# Altium schematic sheet CW308A_Generic_conns.SchDoc
size A4
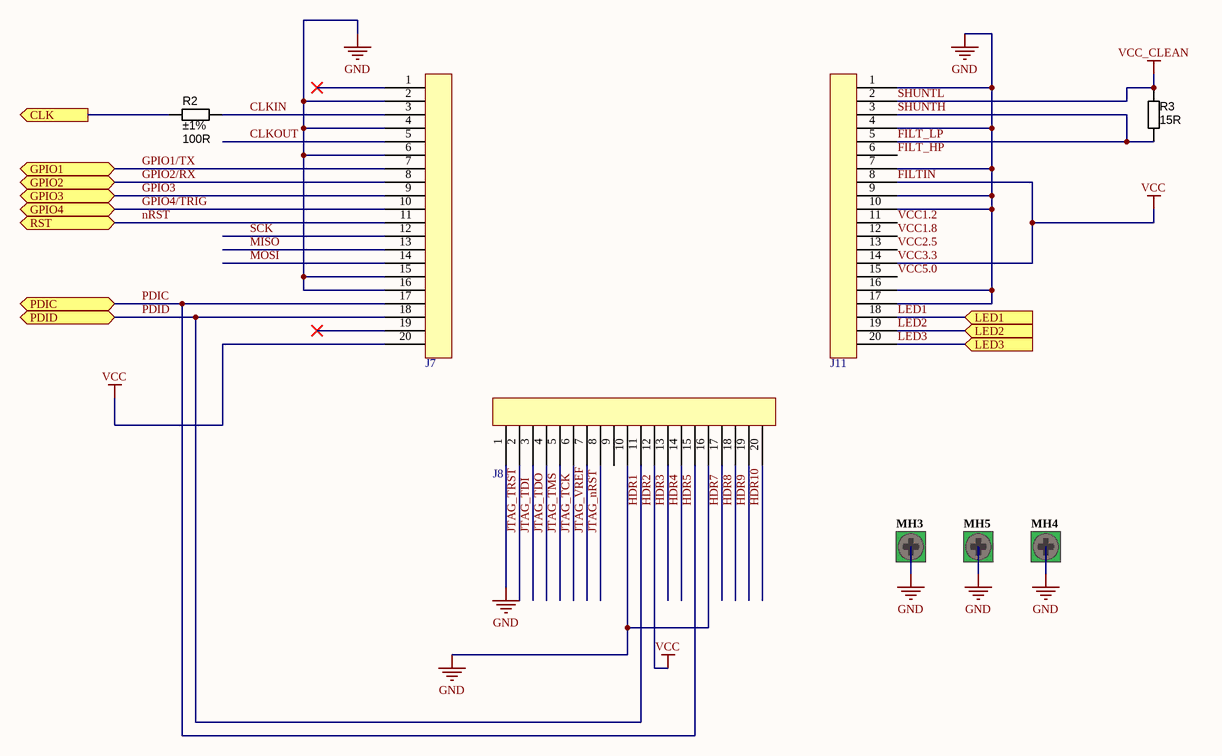
[diagram p0: CW308A_Generic_conns.SchDoc]

## Parts
J7  20-Pin Header  [801-87-020-10-001101]  (value not drawn)
J8  20-Pin Header  [801-87-020-10-001101]  (value not drawn)
J11  20-Pin Header  [801-87-020-10-001101]  (value not drawn)
MH3  Mounting-Hole-RND-Altium  [Mounting-Hole-RND-Altium]  (value not drawn)  (no BOM)
MH4  Mounting-Hole-RND-Altium  [Mounting-Hole-RND-Altium]  (value not drawn)  (no BOM)
MH5  Mounting-Hole-RND-Altium  [Mounting-Hole-RND-Altium]  (value not drawn)  (no BOM)
R2  value 100R  Tolerance: ±1%  [RESC1608X55N]  (hidden comment: Thick Film)
R3  value 15R  [RESC2012X70N]  (hidden comment: Thick Film)

## Ports
CLK (out), GPIO1 (bidir), GPIO2 (bidir), GPIO3 (bidir), GPIO4 (bidir), LED1 (in), LED2 (in), LED3 (in), PDIC (bidir), PDID (bidir), RST (bidir)

## Nets
FILTIN: J7.20 J8.12 J11.8 J11.14  [also labelled HDR2, VCC, VCC3.3]
GND: J7.2 J7.4 J7.6 J7.15 J7.16 J8.1 J8.10 J8.16 J11.1 J11.4 J11.7 J11.9 J11.10 J11.16 J11.17 MH3.1 MH4.1 MH5.1
SHUNTL: J11.2 R3.1  [also labelled VCC_CLEAN]
CLK: R2.1 ; port CLK
CLKIN: J7.3 R2.2
CLKOUT: J7.5
FILT_HP: J11.6
FILT_LP: J11.3 J11.5 R3.2  [also labelled SHUNTH]
GPIO1/TX: J7.7 ; port GPIO1
GPIO2/RX: J7.8 ; port GPIO2
GPIO3: J7.9 ; port GPIO3
GPIO4/TRIG: J7.10 ; port GPIO4
HDR1: J7.18 J8.11 ; port PDID  [also labelled PDID]
HDR3: J8.13
HDR4: J8.14
HDR5: J7.17 J8.15 ; port PDIC  [also labelled PDIC]
HDR7: J8.17
HDR8: J8.18
HDR9: J8.19
HDR10: J8.20
JTAG_nRST: J8.8
JTAG_TCK: J8.6
JTAG_TDI: J8.3
JTAG_TDO: J8.4
JTAG_TMS: J8.5
JTAG_TRST: J8.2
JTAG_VREF: J8.7
LED1: J11.18 ; port LED1
LED2: J11.19 ; port LED2
LED3: J11.20 ; port LED3
MISO: J7.13
MOSI: J7.14
nRST: J7.11 ; port RST
SCK: J7.12
VCC1.2: J11.11
VCC1.8: J11.12
VCC2.5: J11.13
VCC5.0: J11.15

Not connected (* = marked no-connect by the designer): J7 1* 19*; J8 9

## Library data of the parts
J7 J8 J11 = 801-87-020-10-001101: 1x20 Header, Machined; Manufacture 1: Preci-Dip SA; Manufacture Part Number 1: 801-87-020-10-001101; Supplier 1: Digi-Key; Supplier Part Number 1: 1212-1207-ND
MH3-MH5 = CMP-0001-00029-1: Mounting Hole, Altium, 4.4mm pad, 3.4mm plated hole; Publisher: Altium; ClassName: Mounting Hole
R2 = RES_100R_0603_1%: Resistor SMD chip 100 Ohm 0.1W 1% 0603; Manufacturer 1: Yageo; Manufacturer Part Number 1: RC0603FR-07100RL; Ratings: 1/10 W; SCDType: spec; Package / Case: 0603 (1608 Metric); Material: Thick Film; Supplier 1: Digi-Key; Supplier Part Number 1: 311-100HRCT-ND; Supplier 2: Digi-Key; Supplier Part Number 2: P100HTR-ND; Manufacturer 2: Panasonic - ECG; Manufacturer Part Number 2: ERJ-3EKF1000V; ComponentLink1URL: http://industrial.panasonic.com/www-cgi/jvcr13pz.cgi?E+PZ+3+AOA0002+ERJ3EKF1000V+7+WW; ComponentLink1Description: http://industrial.panasonic.com/www-cgi/jvcr13pz.cgi?E+PZ+3+AOA0002+ERJ3EKF1000V+7+WW
R3 = RES_15R_0805_5%: Resistor SMD chip 15 Ohm 0.125W 5% 0805; Manufacturer 1: Yageo; Manufacturer Part Number 1: RC0805JR-0715RL; Ratings: 1/8W; SCDType: spec; Tolerance: ±5%; Package / Case: 0805 (2012 metric); Supplier 1: Digi-Key; Supplier Part Number 1: 311-15ARCT-ND; RoHS 1: RoHS Compliant; ComponentLink1URL: http://media.digikey.com/pdf/Data%20Sheets/Yageo%20PDFs/RC0805%20Pb%20Free.pdf; ComponentLink1Description: http://media.digikey.com/pdf/Data%20Sheets/Yageo%20PDFs/RC0805%20Pb%20Free.pdf; Supplier 2: Digi-Key; Supplier Part Number 2: P15ACT-ND; Manufacturer 2: Panasonic Electronic Components; Manufacturer Part Number 2: ERJ-6GEYJ150V; RoHS 2: RoHS Compliant; ComponentLink2URL: http://industrial.panasonic.com/www-cgi/jvcr13pz.cgi?E+PZ+3+AOA0001+ERJ6GEYJ150V+7+WW; ComponentLink2Description: http://industrial.panasonic.com/www-cgi/jvcr13pz.cgi?E+PZ+3+AOA0001+ERJ6GEYJ150V+7+WW; Supplier 3: Digi-Key; Supplier Part Number 3: RMCF0805JT15R0CT-ND; Manufacturer 3: Stackpole Electronics Inc; Manufacturer Part Number 3: RMCF0805JT15R0; RoHS 3: RoHS Compliant; ComponentLink3URL: http://www.seielect.com/Catalog/SEI-RMCF_RMCP.pdf; ComponentLink3Description: http://www.seielect.com/Catalog/SEI-RMCF_RMCP.pdf; Supplier 4: Digi-Key; Supplier Part Number 4: 541-15ACT-ND; Manufacturer 4: Vishay Dale; Manufacturer Part Number 4: CRCW080515R0JNEA; RoHS 4: RoHS Compliant; ComponentLink4URL: http://www.vishay.com/doc?20035; ComponentLink4Description: http://www.vishay.com/doc?20035